# EAGLE schematic esquema (EAGLE 7.1.0)
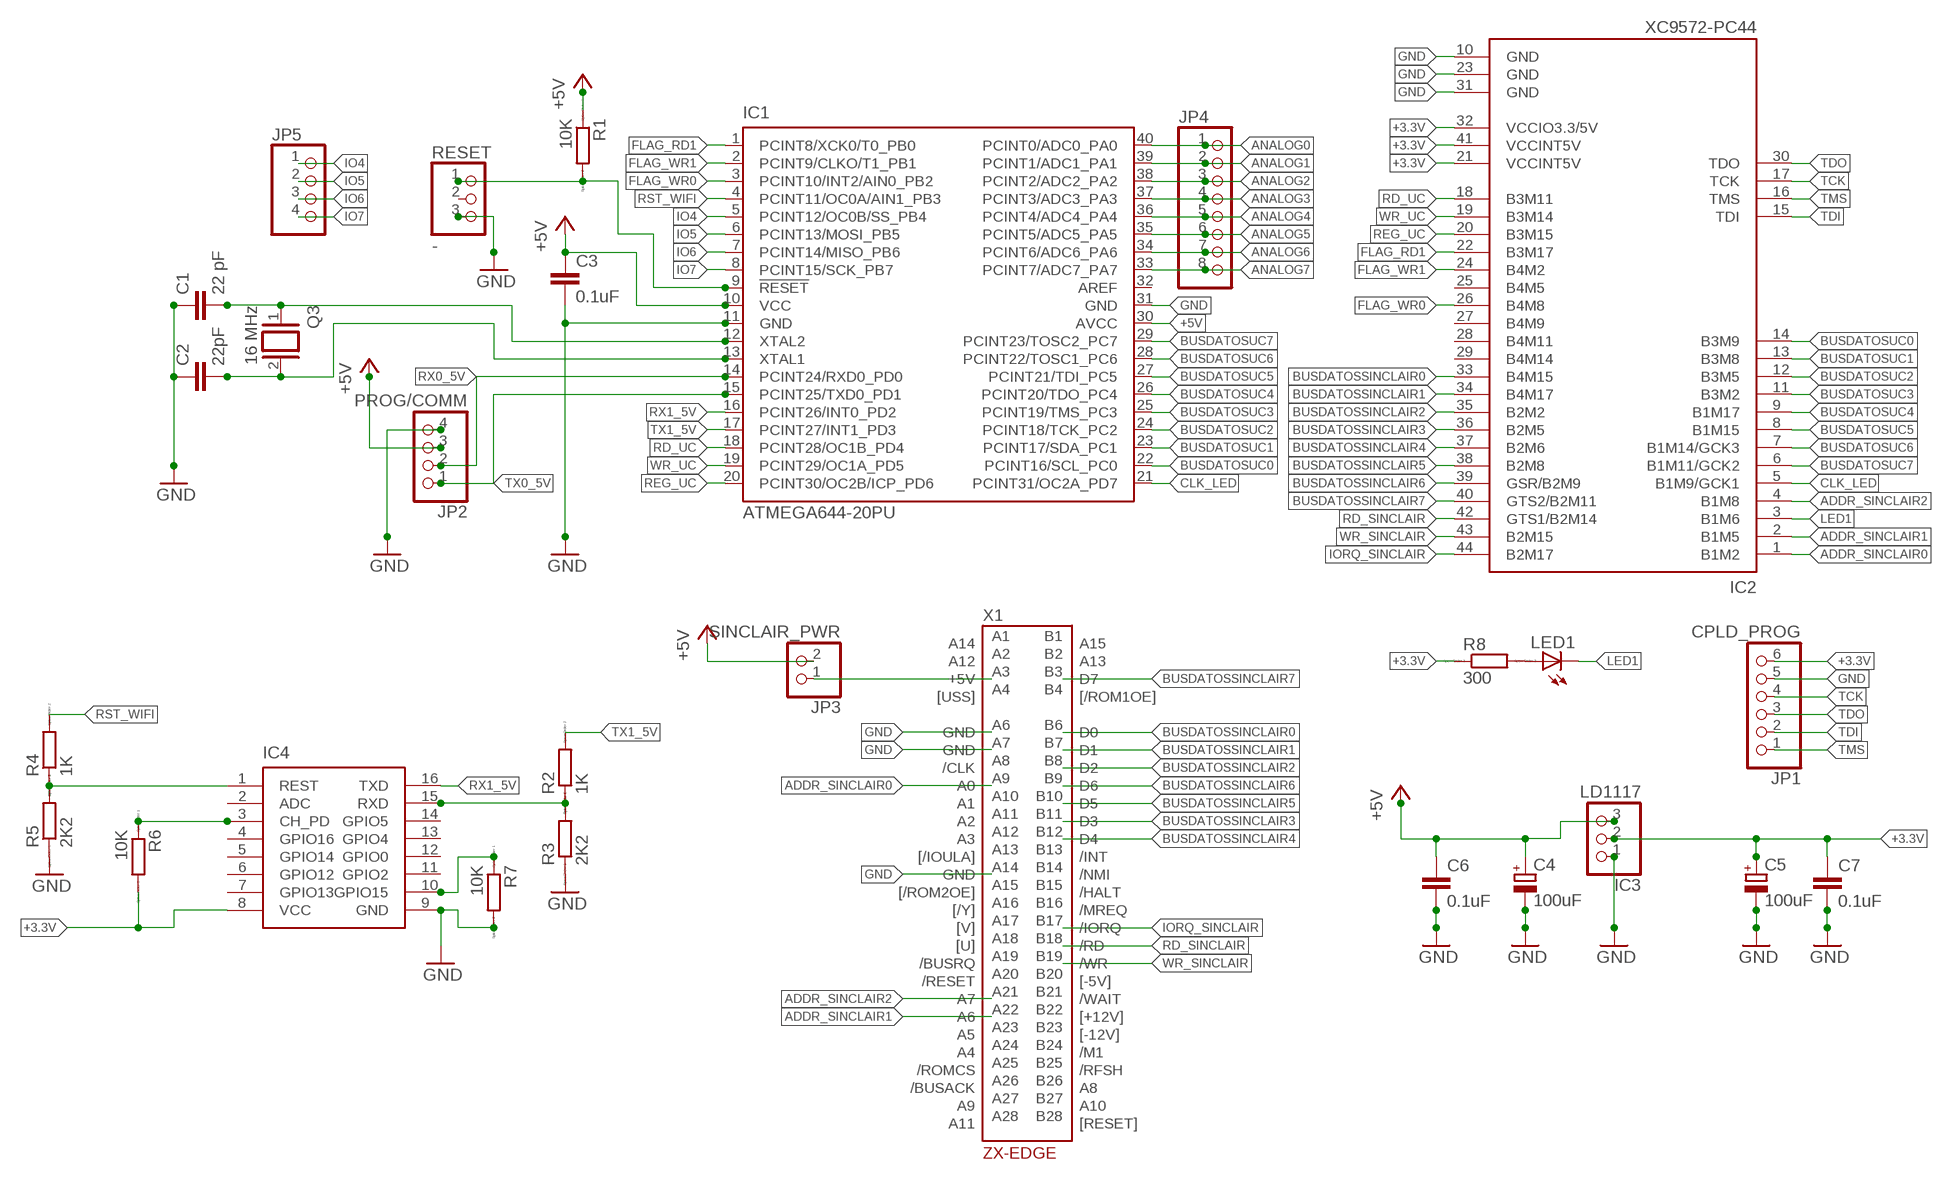
[diagram p0: schematic, sheet 1]

## Parts
C1  22 pF  C-EU025-024X044  [C025-024X044]
C2  22pF  C-EU025-024X044  [C025-024X044]
C3  0.1uF  C-EU025-025X050  [C025-025X050]
C4  100uF  CPOL-EUE2.5-7  [E2,5-7]
C5  100uF  CPOL-EUE2.5-7  [E2,5-7]
C6  0.1uF  C-EU025-025X050  [C025-025X050]
C7  0.1uF  C-EU025-025X050  [C025-025X050]
IC1  ATMEGA644-20PU  [DIL40]
IC2  XC9572-PC44  [PLCC-S44]
IC3  LD1117  PINHD-1X3  [1X03]
IC4  ESP-07ESP-07  [ESP-07]
JP1  CPLD_PROG  PINHD-1X6  [1X06]
JP2  PROG/COMM  PINHD-1X4  [1X04]
JP3  SINCLAIR_PWR  PINHD-1X2  [1X02]
JP4  PINHD-1X8  [1X08]
JP5  PINHD-1X4  [1X04]
LED1  LED3MM  [LED3MM]
Q3  16 MHz  XTAL/S  [QS]
R1  10K  R-EU_0207_10  [0207/10]
R2  1K  R-EU_0207_10  [0207/10]
R3  2K2  R-EU_0207_10  [0207/10]
R4  1K  R-EU_0207_10  [0207/10]
R5  2K2  R-EU_0207_10  [0207/10]
R6  10K  R-EU_0207_10  [0207/10]
R7  10K  R-EU_0207_10  [0207/10]
R8  300  R-EU_0207_10  [0207/10]
RESET  -  PINHD-1X3  [1X03]
X1  ZX-EDGE  [ZX-IFACE]

## Nets
+3.3V [power]: C5.+ C7.1 IC2.21(VCCINT5V) IC2.32(VCCIO3.3/5V) IC2.41(VCCINT5V) IC3.2 IC4.8(VCC) JP1.6 R6.2 R8.1
+5V [power]: C3.1 C4.+ C6.1 IC1.10(VCC) IC1.30(AVCC) IC3.3 JP2.3 JP3.2 R1.1
ADDR_SINCLAIR0: IC2.1(B1M2) X1.A9(A0)
ADDR_SINCLAIR1: IC2.2(B1M5) X1.A22(A6)
ADDR_SINCLAIR2: IC2.4(B1M8) X1.A21(A7)
ANALOG0: IC1.40(PCINT0/ADC0_PA0) JP4.1
ANALOG1: IC1.39(PCINT1/ADC1_PA1) JP4.2
ANALOG2: IC1.38(PCINT2/ADC2_PA2) JP4.3
ANALOG3: IC1.37(PCINT3/ADC3_PA3) JP4.4
ANALOG4: IC1.36(PCINT4/ADC4_PA4) JP4.5
ANALOG5: IC1.35(PCINT5/ADC5_PA5) JP4.6
ANALOG6: IC1.34(PCINT6/ADC6_PA6) JP4.7
ANALOG7: IC1.33(PCINT7/ADC7_PA7) JP4.8
BUSDATOSSINCLAIR0: IC2.33(B4M15) X1.B6(D0)
BUSDATOSSINCLAIR1: IC2.34(B4M17) X1.B7(D1)
BUSDATOSSINCLAIR2: IC2.35(B2M2) X1.B8(D2)
BUSDATOSSINCLAIR3: IC2.36(B2M5) X1.B11(D3)
BUSDATOSSINCLAIR4: IC2.37(B2M6) X1.B12(D4)
BUSDATOSSINCLAIR5: IC2.38(B2M8) X1.B10(D5)
BUSDATOSSINCLAIR6: IC2.39(GSR/B2M9) X1.B9(D6)
BUSDATOSSINCLAIR7: IC2.40(GTS2/B2M11) X1.B3(D7)
BUSDATOSUC0: IC1.22(PCINT16/SCL_PC0) IC2.14(B3M9)
BUSDATOSUC1: IC1.23(PCINT17/SDA_PC1) IC2.13(B3M8)
BUSDATOSUC2: IC1.24(PCINT18/TCK_PC2) IC2.12(B3M5)
BUSDATOSUC3: IC1.25(PCINT19/TMS_PC3) IC2.11(B3M2)
BUSDATOSUC4: IC1.26(PCINT20/TDO_PC4) IC2.9(B1M17)
BUSDATOSUC5: IC1.27(PCINT21/TDI_PC5) IC2.8(B1M15)
BUSDATOSUC6: IC1.28(PCINT22/TOSC1_PC6) IC2.7(B1M14/GCK3)
BUSDATOSUC7: IC1.29(PCINT23/TOSC2_PC7) IC2.6(B1M11/GCK2)
CH_PH_PULLUP: IC4.3(CH_PD) R6.1
CLK_LED: IC1.21(PCINT31/OC2A_PD7) IC2.5(B1M9/GCK1)
FLAG_RD1: IC1.1(PCINT8/XCK0/T0_PB0) IC2.22(B3M17)
FLAG_WR0: IC1.3(PCINT10/INT2/AIN0_PB2) IC2.26(B4M8)
FLAG_WR1: IC1.2(PCINT9/CLKO/T1_PB1) IC2.24(B4M2)
GND [ground]: C1.1 C2.1 C3.2 C4.- C5.- C6.2 C7.2 IC1.11(GND) IC1.31(GND) IC2.10(GND) IC2.23(GND) IC2.31(GND) IC3.1 IC4.9(GND) JP1.5 JP2.4 R3.1 R5.1 R7.2 RESET.3 X1.A6(GND) X1.A7(GND) X1.A14(GND)
GPIO15_PULLDOWN: IC4.10(GPIO15) R7.1
IO4: IC1.5(PCINT12/OC0B/SS_PB4) JP5.1
IO5: IC1.6(PCINT13/MOSI_PB5) JP5.2
IO6: IC1.7(PCINT14/MISO_PB6) JP5.3
IO7: IC1.8(PCINT15/SCK_PB7) JP5.4
IORQ_SINCLAIR: IC2.44(B2M17) X1.B17(/IORQ)
LED1: IC2.3(B1M6) LED1.K(C)
N$1: IC4.15(RXD) R2.1 R3.2
N$2: LED1.A R8.2
N$3: JP3.1 X1.A3(+5V)
OSC1: C1.2 IC1.12(XTAL2) Q3.1
OSC2: C2.2 IC1.13(XTAL1) Q3.2
RD_SINCLAIR: IC2.42(GTS1/B2M14) X1.B18(/RD)
RD_UC: IC1.18(PCINT28/OC1B_PD4) IC2.18(B3M11)
REG_UC: IC1.20(PCINT30/OC2B/ICP_PD6) IC2.20(B3M15)
RESET_UC: IC1.9(!RESET) R1.2 RESET.1
RST_WIFI: IC1.4(PCINT11/OC0A/AIN1_PB3) R4.2
RST_WIFI_3.3V: IC4.1(REST) R4.1 R5.2
RX0_5V: IC1.14(PCINT24/RXD0_PD0) JP2.2
RX1_5V: IC1.16(PCINT26/INT0_PD2) IC4.16(TXD)
TCK: IC2.17(TCK) JP1.4
TDI: IC2.15(TDI) JP1.2
TDO: IC2.30(TDO) JP1.3
TMS: IC2.16(TMS) JP1.1
TX0_5V: IC1.15(PCINT25/TXD0_PD1) JP2.1
TX1_5V: IC1.17(PCINT27/INT1_PD3) R2.2
WR_SINCLAIR: IC2.43(B2M15) X1.B19(/WR)
WR_UC: IC1.19(PCINT29/OC1A_PD5) IC2.19(B3M14)
Unconnected: IC1.32(AREF) IC2.25(B4M5) IC2.27(B4M9) IC2.28(B4M11) IC2.29(B4M14) IC4.2(ADC) IC4.4(GPIO16) IC4.5(GPIO14) IC4.6(GPIO12) IC4.7(GPIO13) IC4.11(GPIO2) IC4.12(GPIO0) IC4.13(GPIO4) IC4.14(GPIO5) RESET.2 X1.A1(A14) X1.A2(A12) X1.A4([USS]) X1.A8(/CLK) X1.A10(A1) X1.A11(A2) X1.A12(A3) X1.A13([/IOULA]) X1.A15([/ROM2OE]) X1.A16([/Y]) X1.A17([V]) X1.A18([U]) X1.A19(/BUSRQ) X1.A20(/RESET) X1.A23(A5) X1.A24(A4) X1.A25(/ROMCS) X1.A26(/BUSACK) X1.A27(A9) X1.A28(A11) X1.B1(A15) X1.B2(A13) X1.B4([/ROM1OE]) X1.B13(/INT) X1.B14(/NMI) X1.B15(/HALT) X1.B16(/MREQ) X1.B20([-5V]) X1.B21(/WAIT) X1.B22([+12V]) X1.B23([-12V]) X1.B24(/M1) X1.B25(/RFSH) X1.B26(A8) X1.B27(A10) X1.B28([RESET])

## Library data of the parts
C1-C3 C6 C7 = rcl:C-EU: CAPACITOR, European symbol
C4 C5 = rcl:CPOL-EU: POLARIZED CAPACITOR, European symbol
IC1 = atmel:ATMEGA644-*PU: 8-bit Microcontroller with 64K Bytes In-System Programmable Flash Auto generated by make-symbol-device-package-bsdl.ulp Rev. 34 Source: http://www.atmel.com/dyn/resources/prod_documents/doc2593.pdf; MPN: ATMEGA644-20PU; OC_FARNELL: 1288340; OC_NEWARK: 23M5060
IC2 = eOscope:XC9572-PC44
IC3 RESET = pinhead:PINHD-1X3: PIN HEADER
IC4 = Esp-07:ESP-07: Esp-07 ESP8266 WiFi module
JP1 = pinhead:PINHD-1X6: PIN HEADER
JP2 JP5 = pinhead:PINHD-1X4: PIN HEADER
JP3 = pinhead:PINHD-1X2: PIN HEADER
JP4 = pinhead:PINHD-1X8: PIN HEADER
LED1 = led:LED: LED OSRAM: - CHIPLED LG R971, LG N971, LY N971, LG Q971, LY Q971, LO R971, LY R971 LH N974, LH R974 LS Q976, LO Q976, LY Q976 LO Q996 - Hyper CHIPLED LW Q18S LB Q993, LB Q99A, LB R99A - SideLED LS A670, LO A670, LY A670, LG A670, LP A670 LB A673, LV A673, LT A673, LW A673 LH A674 LY A675 LS A676, LA A676, LO A676, LY A676, LW A676 LS A679, LY A679, LG A679 - Hyper Micro SIDELED® LS Y876, LA Y876, LO Y876, LY Y876 LT Y87S - SmartLED LW L88C, LW L88S LB L89C, LB L89S, LG L890 LS L89K, LO L89K, LY L89K LS L896, LA L896, LO L896, LY L896 - TOPLED LS T670, LO T670, LY T670, LG T670, LP T670 LSG T670, LSP T670, LSY T670, LOP T670, LYG T670 LG T671, LOG T671, LSG T671 LB T673, LV T673, LT T673, LW T673 LH T674 LS T676, LA T676, LO T676, LY T676, LB T676, LH T676, LSB T676, LW T676 LB T67C, LV T67C, LT T67C, LS T67K, LO T67K, LY T67K, LW E67C LS E67B, LA E67B, LO E67B, LY E67B, LB E67C, LV E67C, LT E67C LW T67C LS T679, LY T679, LG T679 LS T770, LO T770, LY T770, LG T770, LP T770 LB T773, LV T773, LT T773, LW T773 LH T774 LS E675, LA E675, LY E675, LS T675 LS T776, LA T776, LO T776, LY T776, LB T776 LHGB T686 LT T68C, LB T68C - Hyper Mini TOPLED® LB M676 - Mini TOPLED Santana® LG M470 LS M47K, LO M47K, LY M47K Source: http://www.osram.convergy.de LUXEON: - LUMILED® LXK2-PW12-R00, LXK2-PW12-S00, LXK2-PW14-U00, LXK2-PW14-V00 LXK2-PM12-R00, LXK2-PM12-S00, LXK2-PM14-U00 LXK2-PE12-Q00, LXK2-PE12-R00, LXK2-PE12-S00, LXK2-PE14-T00, LXK2-PE14-U00 LXK2-PB12-K00, LXK2-PB12-L00, LXK2-PB12-M00, LXK2-PB14-N00, LXK2-PB14-P00, LXK2-PB14-Q00 LXK2-PR12-L00, LXK2-PR12-M00, LXK2-PR14-Q00, LXK2-PR14-R00 LXK2-PD12-Q00, LXK2-PD12-R00, LXK2-PD12-S00 LXK2-PH12-R00, LXK2-PH12-S00 LXK2-PL12-P00, LXK2-PL12-Q00, LXK2-PL12-R00 Source: www.luxeon.com KINGBRIGHT: KA-3528ASYC Source: www.kingbright.com
Q3 = special:XTAL/S: CRYSTAL
R1-R8 = resistor:R-EU_: RESISTOR, European symbol; SPICEPREFIX: R
X1 = yabus:ZX-EDGE: Opposite part for ZX-Spectrum system bus

## Net classes
0 default: width 0.203 mm
1 ground: width 0.406 mm
2 power: width 0.406 mm